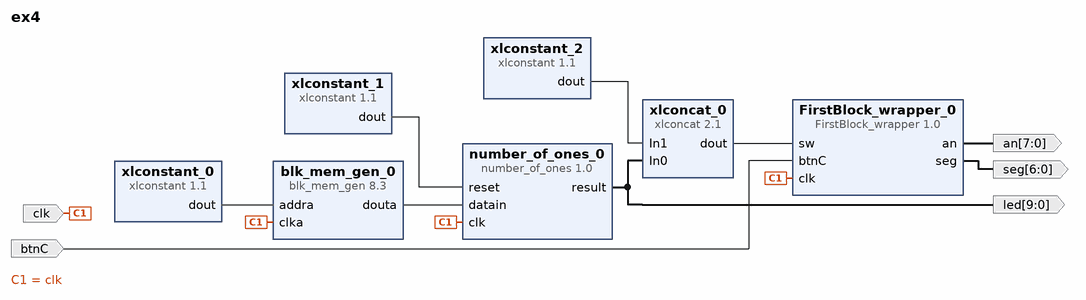
[diagram p0: block diagram of the top level]
# Vivado block design ex4, xc7a100tcsg324-3, Vivado 2016.4
create_bd_design ex4

create_bd_port -dir I clk
create_bd_port -dir O -from 9 -to 0 led
create_bd_port -dir O -from 6 -to 0 seg
create_bd_port -dir O -from 7 -to 0 an
create_bd_port -dir I btnC

create_bd_cell -type ip -vlnv xilinx.com:ip:blk_mem_gen:8.3 blk_mem_gen_0
set_property -dict [list \
  CONFIG.Memory_Type Single_Port_ROM \
  CONFIG.Enable_32bit_Address false \
  CONFIG.Write_Width_A 1024 \
  CONFIG.Enable_A Always_Enabled \
  CONFIG.Register_PortA_Output_of_Memory_Primitives false \
  CONFIG.Register_PortA_Output_of_Memory_Core false \
  CONFIG.Load_Init_File true \
  CONFIG.Coe_File ../../../../../../cr_aula3/vector1024.coe \
  CONFIG.Use_RSTA_Pin false \
  CONFIG.Port_A_Write_Rate 0 \
  CONFIG.use_bram_block Stand_Alone \
] [get_bd_cells blk_mem_gen_0]
create_bd_cell -type ip -vlnv xilinx.com:ip:xlconstant:1.1 xlconstant_0
set_property -dict {CONFIG.CONST_VAL 0} [get_bd_cells xlconstant_0]
create_bd_cell -type ip -vlnv xilinx.com:ip:xlconstant:1.1 xlconstant_1
create_bd_cell -type ip -vlnv xilinx.com:user:number_of_ones:1.0 number_of_ones_0
set_property -dict {CONFIG.number_of_bits_input 1024 CONFIG.number_of_bits_output 10} [get_bd_cells number_of_ones_0]
create_bd_cell -type ip -vlnv xilinx.com:ip:xlconcat:2.1 xlconcat_0
set_property -dict {CONFIG.IN0_WIDTH 10 CONFIG.IN1_WIDTH 6} [get_bd_cells xlconcat_0]
create_bd_cell -type ip -vlnv xilinx.com:ip:xlconstant:1.1 xlconstant_2
set_property -dict {CONFIG.CONST_WIDTH 6 CONFIG.CONST_VAL 0} [get_bd_cells xlconstant_2]
create_bd_cell -type ip -vlnv ua.pt:user:FirstBlock_wrapper:1.0 FirstBlock_wrapper_0

# ---- connections ----

connect_bd_net [get_bd_pins xlconstant_0/dout] [get_bd_pins blk_mem_gen_0/addra]
connect_bd_net [get_bd_ports clk] [get_bd_pins blk_mem_gen_0/clka] [get_bd_pins number_of_ones_0/clk] [get_bd_pins FirstBlock_wrapper_0/clk]
connect_bd_net [get_bd_pins xlconstant_1/dout] [get_bd_pins number_of_ones_0/reset]
connect_bd_net [get_bd_pins blk_mem_gen_0/douta] [get_bd_pins number_of_ones_0/datain]
connect_bd_net [get_bd_pins number_of_ones_0/result] [get_bd_pins xlconcat_0/In0] [get_bd_ports led]
connect_bd_net [get_bd_pins xlconstant_2/dout] [get_bd_pins xlconcat_0/In1]
connect_bd_net [get_bd_pins FirstBlock_wrapper_0/an] [get_bd_ports an]
connect_bd_net [get_bd_pins FirstBlock_wrapper_0/seg] [get_bd_ports seg]
connect_bd_net [get_bd_pins xlconcat_0/dout] [get_bd_pins FirstBlock_wrapper_0/sw]
connect_bd_net [get_bd_ports btnC] [get_bd_pins FirstBlock_wrapper_0/btnC]

validate_bd_design
save_bd_design
